# Altium schematic sheet Peripherals.SchDoc
size A4; SheetNumber: 4; SheetTotal: 4
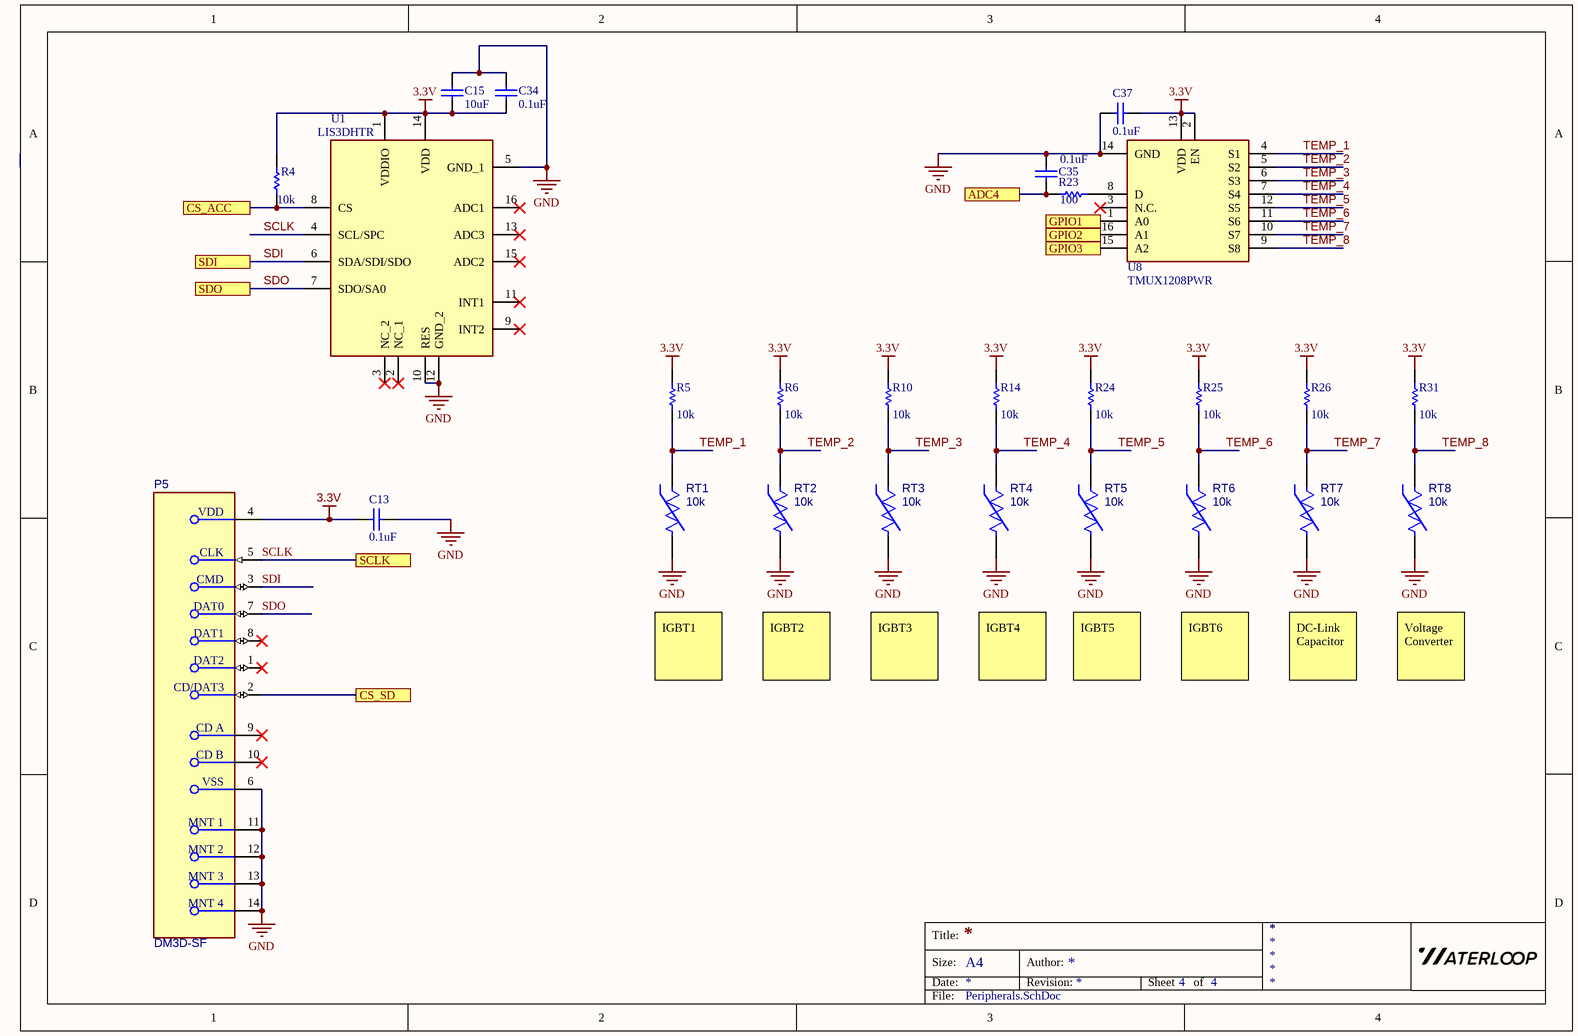
[diagram p0: Peripherals.SchDoc]

## Parts
C13  value 0.1uF  [0805 - Capacitor]  (hidden comment: 100V)
C15  value 10uF  [0805 - Capacitor]  (hidden comment: 100V)
C34  value 0.1uF  [0805 - Capacitor]  (hidden comment: 100V)
C35  value 0.1uF  [0805 - Capacitor]  (hidden comment: 100V)
C37  value 0.1uF  [0805 - Capacitor]  (hidden comment: 100V)
P5  DM3D-SF  [FP-DM3D-SF-MFG]
R4  10k  [0603 - Resistor]
R5  10k  [0603 - Resistor]
R6  10k  [0603 - Resistor]
R10  10k  [0603 - Resistor]
R14  10k  [0603 - Resistor]
R23  100  [0603 - Resistor]
R24  10k  [0603 - Resistor]
R25  10k  [0603 - Resistor]
R26  10k  [0603 - Resistor]
R31  10k  [0603 - Resistor]
RT1  10k  [ERT-J1VG103JA]
RT2  10k  [ERT-J1VG103JA]
RT3  10k  [ERT-J1VG103JA]
RT4  10k  [ERT-J1VG103JA]
RT5  10k  [ERT-J1VG103JA]
RT6  10k  [ERT-J1VG103JA]
RT7  10k  [ERT-J1VG103JA]
RT8  10k  [ERT-J1VG103JA]
U1  LIS3DHTR  [LIS3DHTR]
U8  TMUX1208PWR  [SOP65P640X120-16N]

## Ports
ADC4, CS_ACC, CS_SD, GPIO1, GPIO2, GPIO3, SCLK, SDI, SDO

## Nets
3.3V: C13.2 C15.2 C34.2 C37.1 P5.4(VDD) R4.2 R5.1 R6.2 R10.2 R14.2 R24.2 R25.2 R26.2 R31.2 U1.1(VDDIO) U1.14(VDD) U8.2(EN) U8.13(VDD)
GND: C13.1 C15.1 C34.1 C35.1 C37.2 P5.6(VSS) P5.11(MNT_1) P5.12(MNT_2) P5.13(MNT_3) P5.14(MNT_4) RT1.2 RT2.2 RT3.2 RT4.2 RT5.2 RT6.2 RT7.2 RT8.2 U1.5(GND_1) U1.10(RES) U1.12(GND_2) U8.14(GND)
ADC4: C35.2 R23.2 ; port ADC4
CS_ACC: R4.1 U1.8(CS) ; port CS_ACC
CS_SD: P5.2(CD/DAT3) ; port CS_SD
GPIO1: U8.1(A0) ; port GPIO1
GPIO2: U8.16(A1) ; port GPIO2
GPIO3: U8.15(A2) ; port GPIO3
SCLK: P5.5(CLK) U1.4(SCL/SPC) ; port SCLK
SDI: P5.3(CMD) U1.6(SDA/SDI/SDO) ; port SDI
SDO: P5.7(DAT0) U1.7(SDO/SA0) ; port SDO
TEMP_1: R5.2 RT1.1 U8.4(S1)
TEMP_2: R6.1 RT2.1 U8.5(S2)
TEMP_3: R10.1 RT3.1 U8.6(S3)
TEMP_4: R14.1 RT4.1 U8.7(S4)
TEMP_5: R24.1 RT5.1 U8.12(S5)
TEMP_6: R25.1 RT6.1 U8.11(S6)
TEMP_7: R26.1 RT7.1 U8.10(S7)
TEMP_8: R31.1 RT8.1 U8.9(S8)
NetR23_1: R23.1 U8.8(D)

Not connected (* = marked no-connect by the designer): P5 1(DAT2)* 8(DAT1)* 9(CD_A)* 10(CD_B)*; U1 2(NC_1)* 3(NC_2)* 9(INT2)* 11(INT1)* 13(ADC3)* 15(ADC2)* 16(ADC1)*; U8 3(N.C.)*

## Notes on the sheet
- IGBT1
- IGBT2
- IGBT3
- IGBT4
- IGBT5
- IGBT6
- DC-Link Capacitor
- Voltage Converter
- Title:
- Size:
- Date:
- A4
- Author:
- Revision:
- Sheet
- of
- File:

## Library data of the parts
C13 C15 C34 C35 C37 = Capacitor - Nonpolarized: CL21B104KCFNNNE, MULTILAYER CERAMIC CAPACITORS MLCC - SMD/SMT 100NF 100V 0805 ROHS; Supplier Part Number: *; Supplier: *; Manufacturer: *; Rating: *; Manufacturer Part Number: *
P5 = CMP-2000-06166-2: CONN MICRO SD CARD PUSH-PULL; Insulation Resistance: 1GR; Max Voltage Rating (AC): 125V; Gender: Female; Contact Resistance: 100mR; Current Rating: 500mA; Pitch: 1.1mm; Connector Type: Connector; Number of Contacts: 8; Contact Plating: Gold; Number of Rows: 1; Termination: Solder; Contact Material: Copper Alloy; REACH SVHC: No SVHC; Voltage Rating (AC): 125V; Packaging: Tape and Reel; Housing Material: Polymer; Max Operating Temperature: 85°C; Package Quantity: 1; Min Operating Temperature: -25°C; Lead Free: Lead Free; Orientation: Right Angle; Radiation Hardening: No; Flammability Rating: UL94 V-0; Mount: Surface Mount; Depth: 11.45mm; Max Current Rating: 500mA; Length: 11.95mm; Width: 11.95mm
R4-R6 R10 R14 R23-R26 R31 = Resistor: Rating: *; Manufacturer Part Number: *; Manufacturer: *; Supplier Part Number: *; Supplier: *
  R4-R6 R10 R14 R24-R26 R31: Value: 10k
  R23: Value: 100
RT1-RT8 = ERT-J1VG103JA: NTC Thermistor for Temperature Sensor, SMD 0603, 10kΩ; Resistance Tolerance: 1%; Current Rating: 140uA; Power Rating: 100mW; Resistance: 47kR; Case/Package: 0402; Packaging: Tape and Reel; Radiation Hardening: No; Min Operating Temperature: -40°C; Lead Free: Lead Free; Mount: Surface Mount; RoHS Compliant: Yes; Number of Pins: 2; Package Quantity: 10000; Case Code (Metric): 1005; Max Operating Temperature: 125°C; Max Power Dissipation: 100mW; Series: NCP; Height: 0.5mm; Depth: 0.5mm; Termination: SMD/SMT; Case Code (Imperial): 0402; Tolerance: 1%; Length: 1mm
U1 = LIS3DHTR: Accelerometer; Manufacturer_Name: STMicroelectronics; Datasheet Link: http://www.st.com/content/ccc/resource/technical/document/datasheet/3c/ae/50/85/d6/b1/46/fe/CD00274221.pdf/files/CD00274221.pdf/jcr:content/translations/en.CD00274221.pdf; Height: 1mm; Manufacturer_Part_Number: LIS3DHTR; Mouser Part Number: 511-LIS3DHTR; Mouser Price/Stock: https://www.mouser.co.uk/ProductDetail/STMicroelectronics/LIS3DHTR/?qs=6la6oa3D8xzhXYax3cEo4w%3D%3D; Arrow Part Number: LIS3DHTR; Arrow Price/Stock: https://www.arrow.com/en/products/lis3dhtr/stmicroelectronics
U8 = TMUX1208PWR: Integrated Circuit; Manufacturer_Name: Texas Instruments; Datasheet Link: http://www.ti.com/lit/gpn/tmux1208; Height: 1.2mm; Manufacturer_Part_Number: TMUX1208PWR; Mouser Part Number: 595-TMUX1208PWR; Mouser Price/Stock: https://www.mouser.co.uk/ProductDetail/Texas-Instruments/TMUX1208PWR/?qs=lc2O%252BfHJPVbYdIGs2%2FdugA%3D%3D; Arrow Part Number: TMUX1208PWR; Arrow Price/Stock: https://www.arrow.com/en/products/tmux1208pwr/texas-instruments